# EAGLE schematic e-Tapperhandpiece1 (EAGLE 8.2.2)
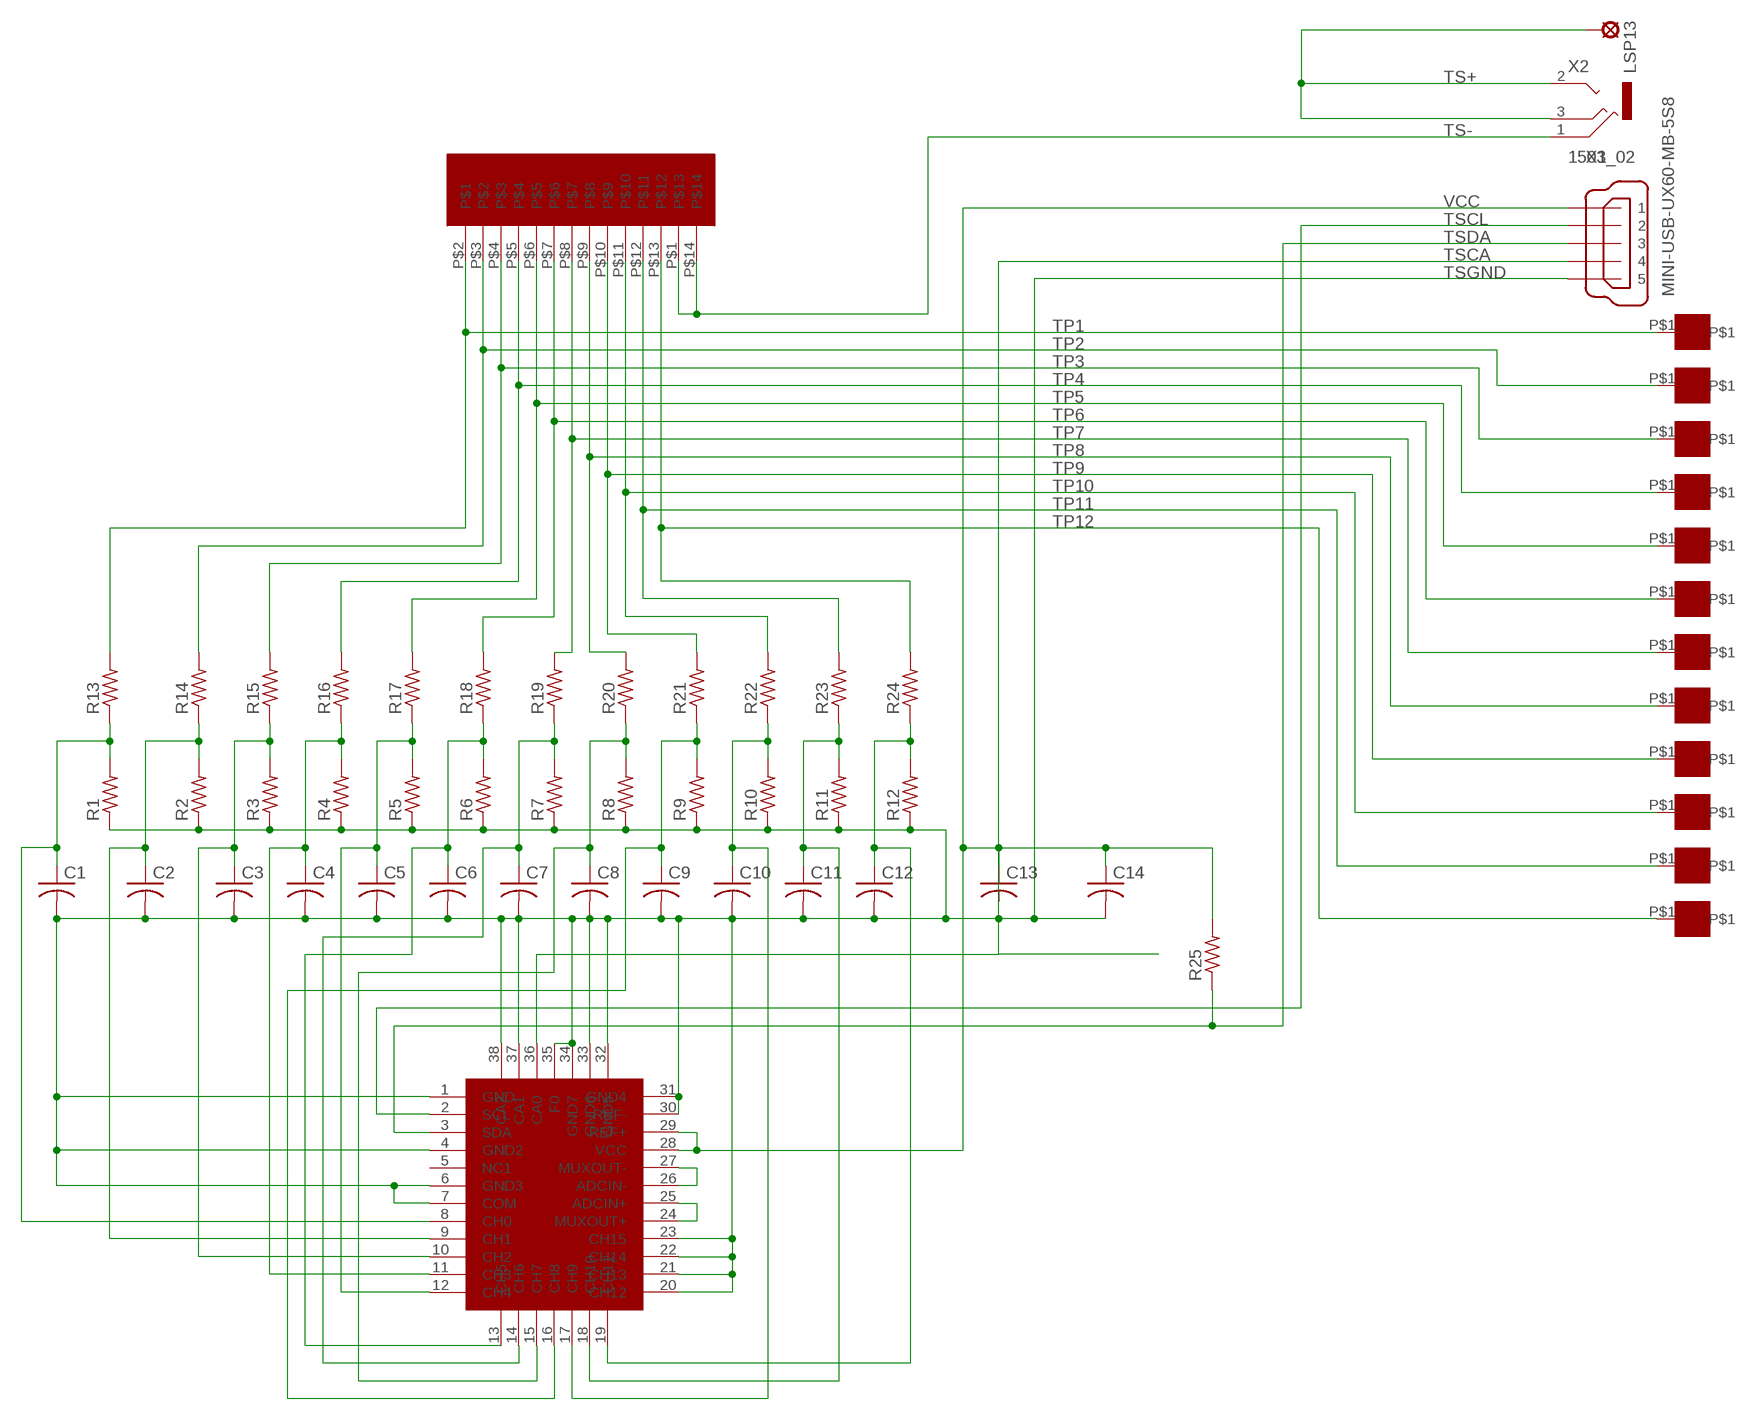
[diagram p0: schematic, sheet 1]

## Parts
C1  C-USC0805  [C0805]
C2  C-USC0805  [C0805]
C3  C-USC0805  [C0805]
C4  C-USC0805  [C0805]
C5  C-USC0805  [C0805]
C6  C-USC0805  [C0805]
C7  C-USC0805  [C0805]
C8  C-USC0805  [C0805]
C9  C-USC0805  [C0805]
C10  C-USC0805  [C0805]
C11  C-USC0805  [C0805]
C12  C-USC0805  [C0805]
C13  C-USC0805  [C0805]
C14  C-USC0805  [C0805]
LSP13  SE11  [SE11]
R1  R-US_R0402  [R0402]
R2  R-US_R0402  [R0402]
R3  R-US_R0402  [R0402]
R4  R-US_R0402  [R0402]
R5  R-US_R0402  [R0402]
R6  R-US_R0402  [R0402]
R7  R-US_R0402  [R0402]
R8  R-US_R0402  [R0402]
R9  R-US_R0402  [R0402]
R10  R-US_R0402  [R0402]
R11  R-US_R0402  [R0402]
R12  R-US_R0402  [R0402]
R13  R-US_R0402  [R0402]
R14  R-US_R0402  [R0402]
R15  R-US_R0402  [R0402]
R16  R-US_R0402  [R0402]
R17  R-US_R0402  [R0402]
R18  R-US_R0402  [R0402]
R19  R-US_R0402  [R0402]
R20  R-US_R0402  [R0402]
R21  R-US_R0402  [R0402]
R22  R-US_R0402  [R0402]
R23  R-US_R0402  [R0402]
R24  R-US_R0402  [R0402]
R25  R-US_R0402  [R0402]
TSP1  ET1  [ET1]
TSP2  ET1  [ET1]
TSP3  ET1  [ET1]
TSP4  ET1  [ET1]
TSP5  ET1  [ET1]
TSP6  ET1  [ET1]
TSP7  ET1  [ET1]
TSP8  ET1  [ET1]
TSP9  ET1  [ET1]
TSP10  ET1  [ET1]
TSP11  ET1  [ET1]
TSP12  ET1  [ET1]
U$1  LTC2497  [QFN38-5X7]
U$2  SS112D01  [SS112D01]
X1  MINI-USB-UX60-MB-5S8  [UX60-MB-5S8]
X2  1503_02  [1503_02]

## Nets
N$1: C9.1 R9.2 R21.1 U$1.16(CH8)
N$2: U$1.26(ADCIN-) U$1.27(MUXOUT-)
N$3: U$1.24(MUXOUT+) U$1.25(ADCIN+)
N$5: C12.1 R12.2 R24.1 U$1.19(CH11)
N$7: C4.1 R4.2 R16.1 U$1.11(CH3)
N$8: C10.1 R10.2 R22.1 U$1.17(CH9)
N$9: C8.1 R8.2 R20.1 U$1.15(CH7)
N$18: C5.1 R5.2 R17.1 U$1.12(CH4)
N$19: C6.1 R6.2 R18.1 U$1.13(CH5)
N$20: C7.1 R7.2 R19.1 U$1.14(CH6)
N$22: C3.1 R3.2 R15.1 U$1.10(CH2)
N$23: C2.1 R2.2 R14.1 U$1.9(CH1)
N$24: C11.1 R11.2 R23.1 U$1.18(CH10)
N$25: C1.1 R1.2 R13.1 U$1.8(CH0)
TP1: R13.2 TSP1.P$1 U$2.P$2
TP2: R14.2 TSP2.P$1 U$2.P$3
TP3: R15.2 TSP3.P$1 U$2.P$4
TP4: R16.2 TSP4.P$1 U$2.P$5
TP5: R17.2 TSP5.P$1 U$2.P$6
TP6: R18.2 TSP6.P$1 U$2.P$7
TP7: R19.2 TSP7.P$1 U$2.P$8
TP8: R20.2 TSP8.P$1 U$2.P$9
TP9: R21.2 TSP9.P$1 U$2.P$10
TP10: R22.2 TSP10.P$1 U$2.P$11
TP11: R23.2 TSP11.P$1 U$2.P$12
TP12: R24.2 TSP12.P$1 U$2.P$13
TS+: LSP13.MP X2.2 X2.3
TS-: U$2.P$1 U$2.P$14 X2.1
TSCA: U$1.36(CA0) X1.4
TSCL: U$1.2(SCL) X1.2
TSDA: R25.1 U$1.3(SDA) X1.3
TSGND: C1.2 C2.2 C3.2 C4.2 C5.2 C6.2 C7.2 C8.2 C9.2 C10.2 C11.2 C12.2 C13.2 C14.2 R1.1 R2.1 R3.1 R4.1 R5.1 R6.1 R7.1 R8.1 R9.1 R10.1 R11.1 R12.1 U$1.1(GND) U$1.4(GND2) U$1.6(GND3) U$1.7(COM) U$1.20(CH12) U$1.21(CH13) U$1.22(CH14) U$1.23(CH15) U$1.30(REF-) U$1.31(GND4) U$1.32(GND5) U$1.33(GND6) U$1.34(GND7) U$1.35(F0) U$1.37(CA1) U$1.38(CA2)
VCC: C13.1 C14.1 R25.2 U$1.28(VCC) U$1.29(REF+) X1.1
Unconnected: U$1.5(NC1) X1.5 X2.2@2

## Library data of the parts
C1-C14 = rcl:C-US: CAPACITOR, American symbol
LSP13 = solpad:SE11: SOLDER PAD RTM, drill 1,1mm, distributor Buerklin, 07F810
R1-R25 = resistor:R-US_: RESISTOR, American symbol
TSP1-TSP12 = ET1:ET1: Through Hold Pads 20 mil drill hole
U$1 = LTC2497:LTC2497: LTC2497 16 Channel ADC with I2C interface
U$2 = SS112D01:SS112D01
X1 = con-hirose:MINI-USB-: MINI USB Connector Source: http://www.hirose.co.jp/cataloge_hp/e24000019.pdf; OC_FARNELL: unknown; OC_NEWARK: unknown
X2 = con-lumberg:1503_02: Jack connectors according to JISC 6560, 3.5 mm Klinkeneinbaukupplung nach JISC 6560, 3,5 mm, 3-polig/stereo, abgewinkelte Ausführung, Surface-Mount-Technik (SMT) Source: http://www.lumberg.com/Produkte/PDFs/1503_02.pdf; OC_FARNELL: 1216979; OC_NEWARK: unknown

## Net classes
0 default: clearance 0.205 mm